# EasyEDA schematic blink-bot.json
TITLE: Sheet_1; REV: 1.0; Date: 2025-10-17; Sheet: 1/1; Company: Your Company
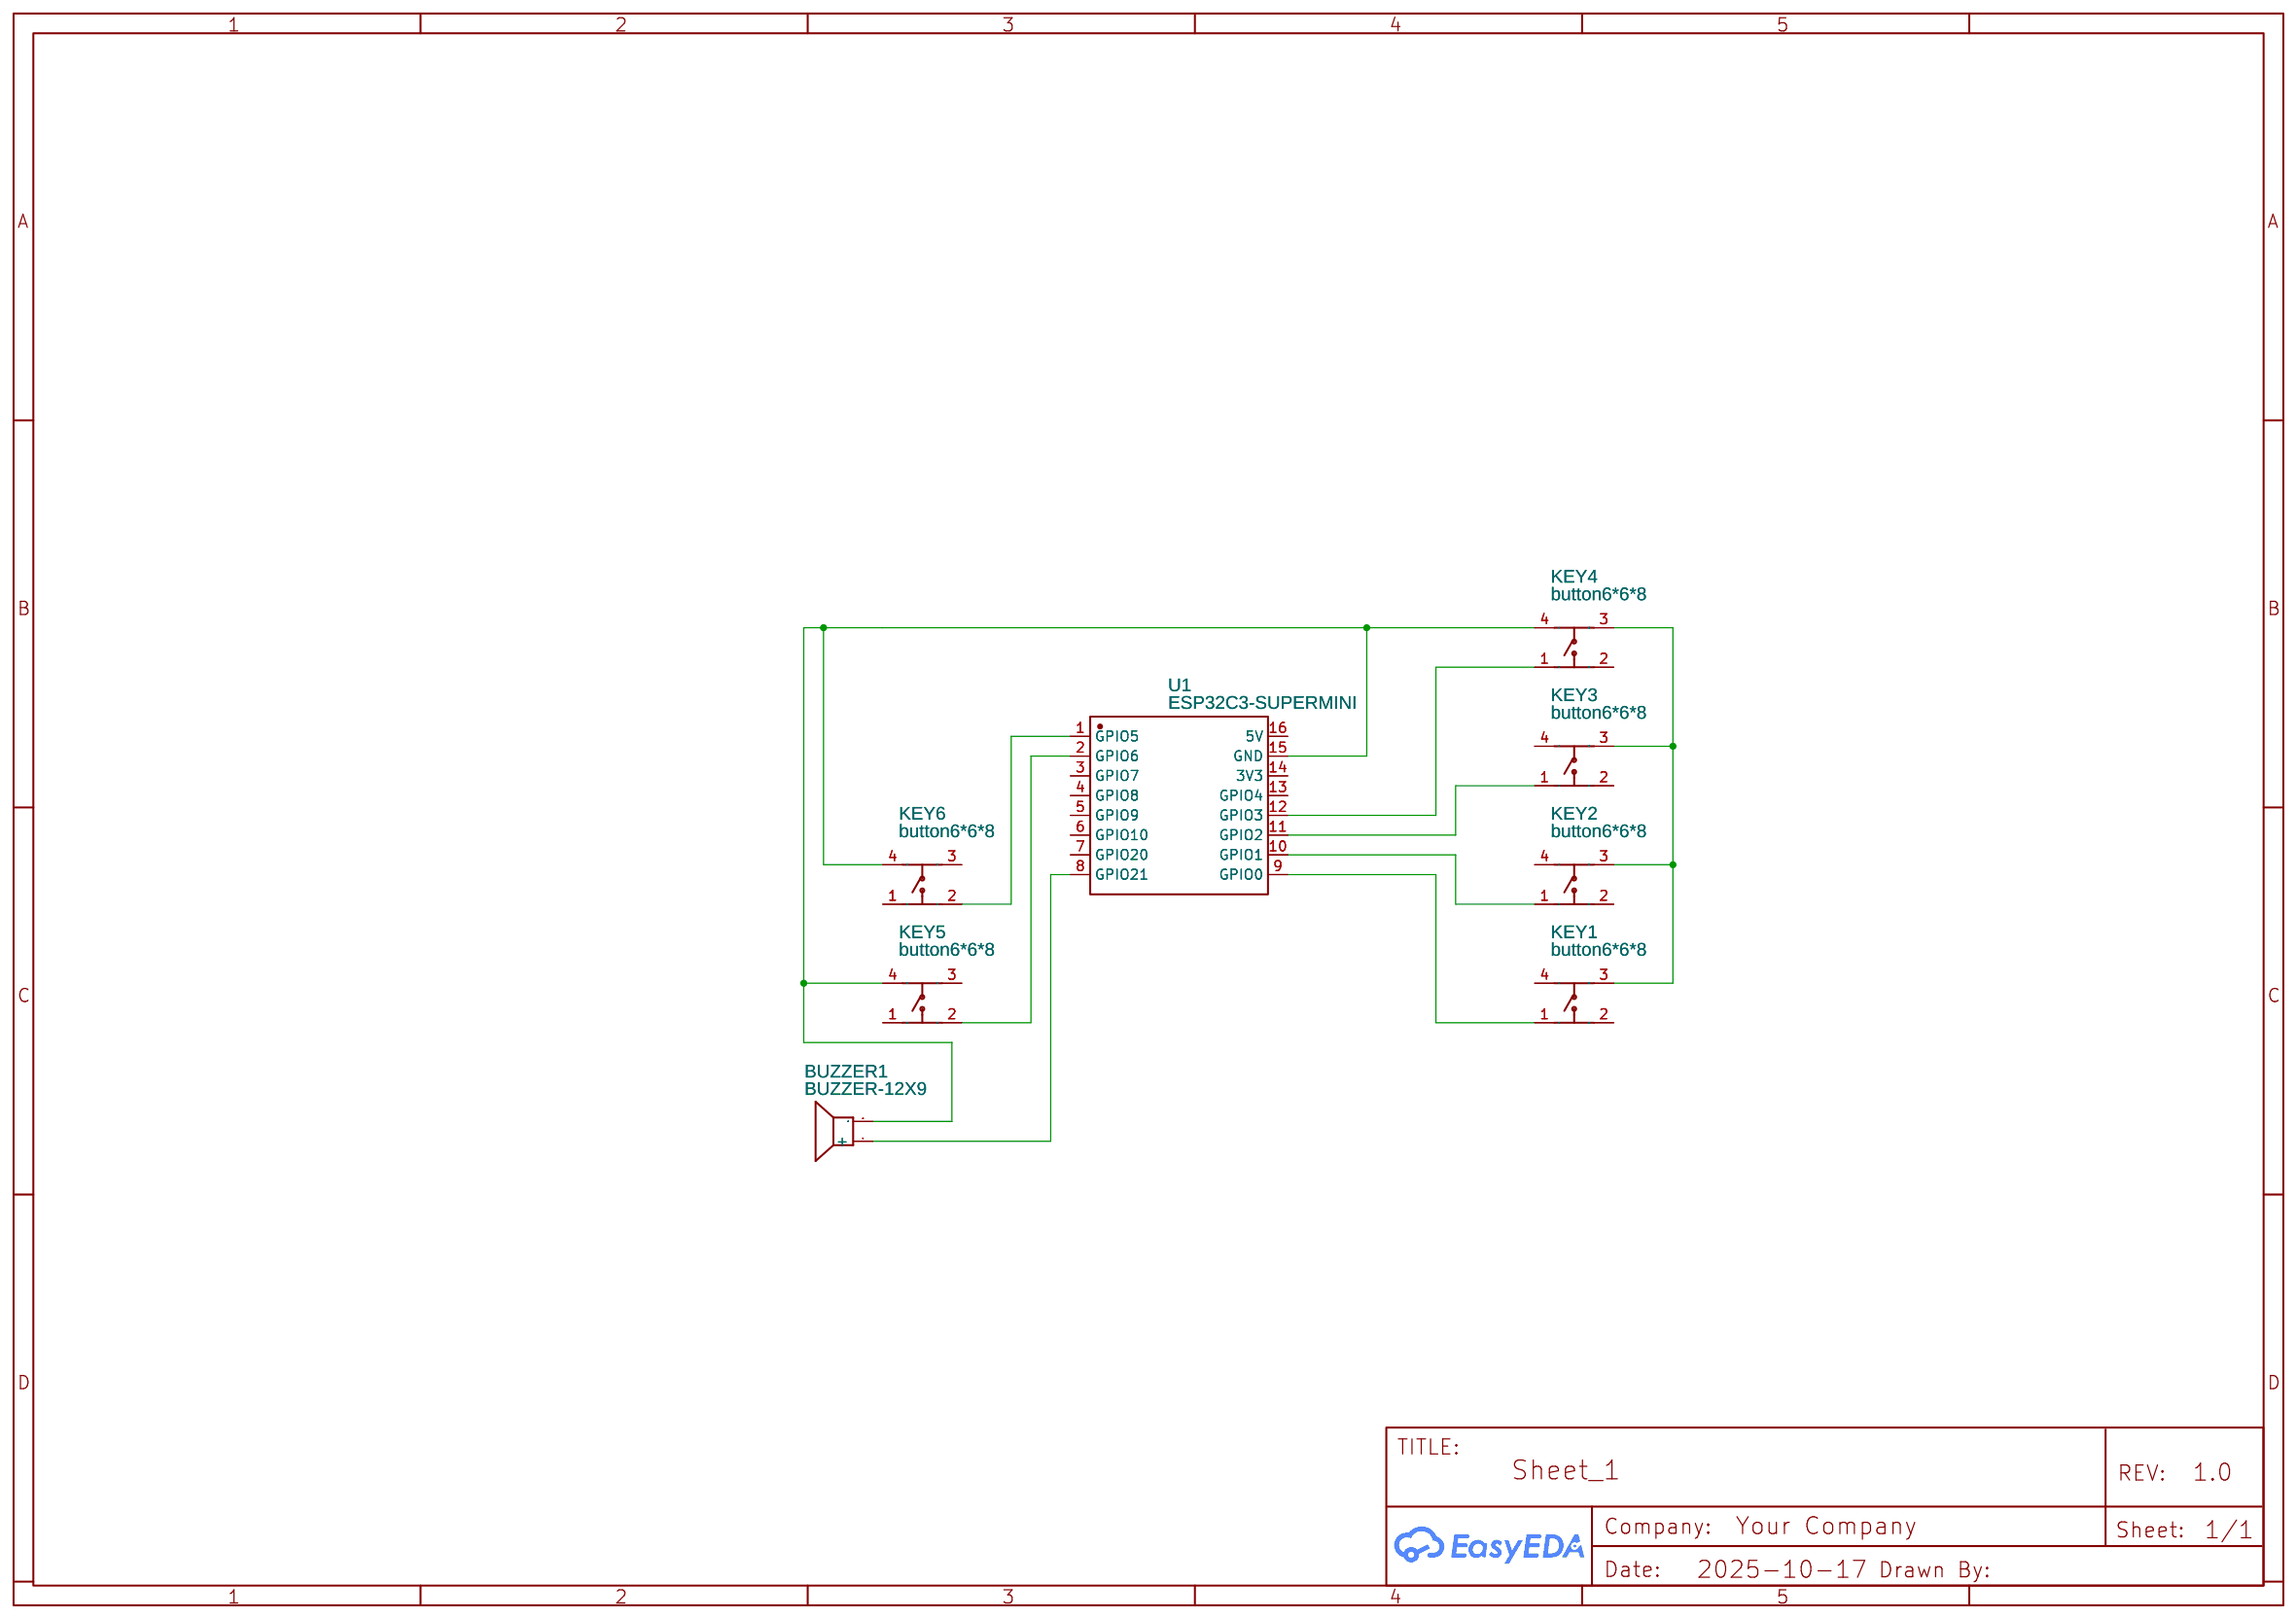
[diagram p0: schematic sheet]

## Parts
BUZZER1  BUZZER-12X9  [BUZ-TH_BD12.0-P7.60-D0.6-FD]
KEY1  button6*6*8  [KEY-TH_4P-L6.0-W6.0-P4.50-LS7.5]
KEY2  button6*6*8  [KEY-TH_4P-L6.0-W6.0-P4.50-LS7.5]
KEY3  button6*6*8  [KEY-TH_4P-L6.0-W6.0-P4.50-LS7.5]
KEY4  button6*6*8  [KEY-TH_4P-L6.0-W6.0-P4.50-LS7.5]
KEY5  button6*6*8  [KEY-TH_4P-L6.0-W6.0-P4.50-LS7.5]
KEY6  button6*6*8  [KEY-TH_4P-L6.0-W6.0-P4.50-LS7.5]
U1  ESP32C3-SUPERMINI  [COMM-SMD_16P-L22.5-W18.0-P2.54-TL]

## Library data of the parts
BUZZER1 = BUZZER-12X9: Contributor: lcsc; Supplier: LCSC; Supplier Part: C9900016920; Manufacturer: null; Manufacturer Part: buzzer-12X9; JLCPCB Part Class: Extended Part
KEY1-KEY6 = button6*6*8: Supplier Part: C59982; Supplier: LCSC; Manufacturer: ReliaPro; JLCPCB Part Class: Extended Part
U1 = ESP32C3-SUPERMINI: Supplier: LCSC; Supplier Part: C9900147397; Manufacturer: null; Manufacturer Part: ESP32C3-SuperMini; JLCPCB Part Class: Extended Part; Contributor: lcsc

## Nets
Net-(BUZZER1-1): BUZZER1.1(+) U1.8(GPIO21)
Net-(BUZZER1-2): BUZZER1.2 KEY4.4 KEY5.4 KEY6.4 U1.15(GND)
Net-(KEY1-1): KEY1.1 U1.9(GPIO0)
Net-(KEY1-3): KEY1.3 KEY2.3 KEY3.3 KEY4.3
Net-(KEY2-1): KEY2.1 U1.10(GPIO1)
Net-(KEY3-1): KEY3.1 U1.11(GPIO2)
Net-(KEY4-1): KEY4.1 U1.12(GPIO3)
Net-(KEY5-2): KEY5.2 U1.2(GPIO6)
Net-(KEY6-2): KEY6.2 U1.1(GPIO5)

Not connected (* = marked no-connect by the designer): KEY1 2 4; KEY2 2 4; KEY3 2 4; KEY4 2; KEY5 1 3; KEY6 1 3; U1 3(GPIO7) 4(GPIO8) 5(GPIO9) 6(GPIO10) 7(GPIO20) 13(GPIO4) 14(3V3) 16(5V)
